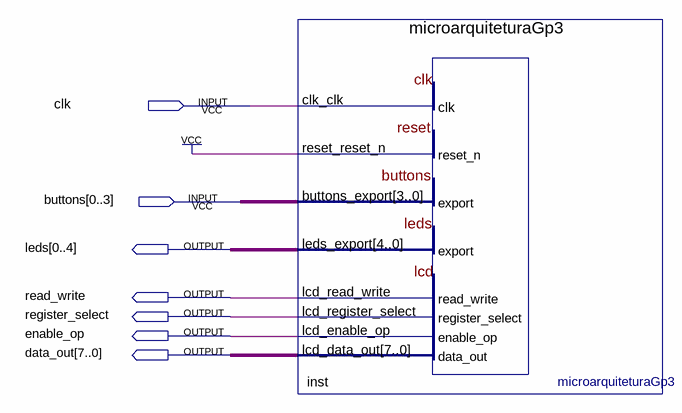
[diagram p0: schematic sheet]
// Quartus schematic microarquitetura.bdf as structural Verilog: 1 symbols, 7 pins
module microarquitetura (
  input  clk,
  input  [0:3] buttons,
  output [0:4] leds,
  output read_write,
  output register_select,
  output enable_op,
  output [7:0] data_out
);

  microarquiteturaGp3 inst (
    .clk_clk(clk), .reset_reset_n(1'b1), .buttons_export(buttons), .leds_export(leds),
    .lcd_read_write(read_write), .lcd_register_select(register_select), .lcd_enable_op(enable_op),
    .lcd_data_out(data_out));
endmodule
